# EAGLE design gatedriver_trafo_sma_compact_ACDC_SMD (EAGLE 7.2.0)
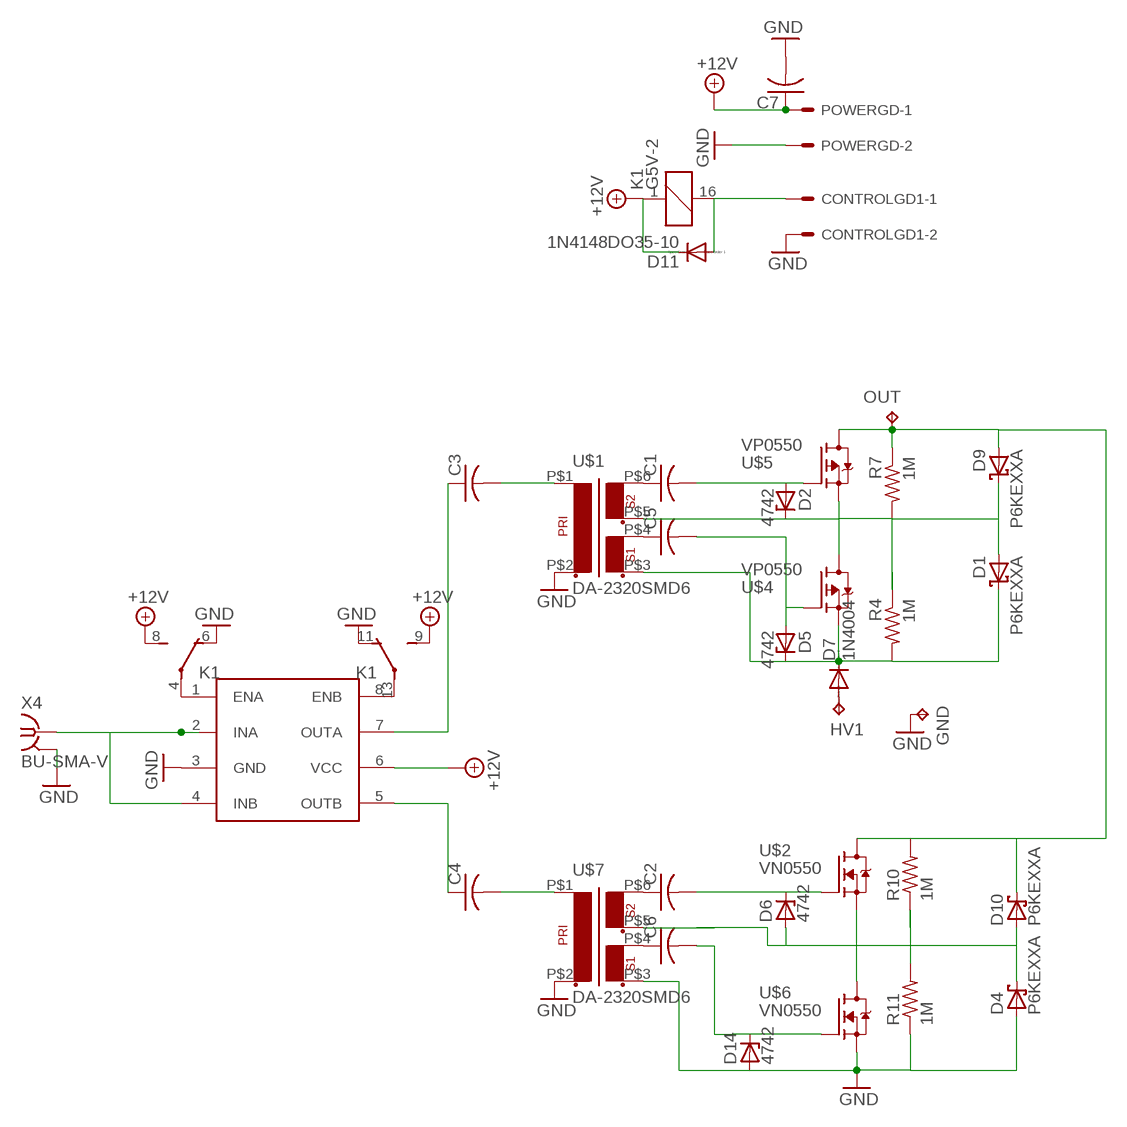
[diagram p0: schematic, sheet 1]

## Parts
C1  C-US050-055X075  [C050-055X075]
C2  C-US050-055X075  [C050-055X075]
C3  C-US050-055X075  [C050-055X075]
C4  C-US050-055X075  [C050-055X075]
C5  C-US050-055X075  [C050-055X075]
C6  C-US050-055X075  [C050-055X075]
C7  C-US050-030X075  [C050-030X075]
CONTROLGD1  KK-156-2  [KK-156-2]
D1  P6KEXXA  [C1702-15]
D2  4742  ZENER-DIODEZD-10  [ZDIO-10]
D4  P6KEXXA  [C1702-15]
D5  4742  ZENER-DIODEZD-10  [ZDIO-10]
D6  4742  ZENER-DIODEZD-10  [ZDIO-10]
D7  1N4004  [DO41-10]
D9  P6KEXXA  [C1702-15]
D10  P6KEXXA  [C1702-15]
D11  1N4148DO35-10  [DO35-10]
D14  4742  ZENER-DIODEZD-10  [ZDIO-10]
GND  TPPAD1-20Y  [P1-20Y]
HV1  TPPAD1-20Y  [P1-20Y]
K1  G5V-2  [G5V-2]
OUT  TPPAD1-20Y  [P1-20Y]
POWERGD  KK-156-2  [KK-156-2]
R4  1M  R-US_0207/12  [0207/12]
R7  1M  R-US_0207/12  [0207/12]
R10  1M  R-US_0207/12  [0207/12]
R11  1M  R-US_0207/12  [0207/12]
U$1  DA-2320SMD6  [SMD6]
U$2  VN0550  [TO92-]
U$3  UCC27425  [DIL08]
U$4  VP0550  [TO92-]
U$5  VP0550  [TO92-]
U$6  VN0550  [TO92-]
U$7  DA-2320SMD6  [SMD6]
X4  BU-SMA-V  [BU-SMA-V]

## Nets
+15V: C7.1 D11.C K1.1 K1.8(1:S) K1.9(2:S) POWERGD.1 U$3.6(VCC) ; supply symbol labelled +12V
ENSW: CONTROLGD1.1 D11.A K1.16
GND: C7.2 CONTROLGD1.2 D4.A D14.A GND.TP K1.6(1:O) K1.11(2:O) POWERGD.2 R11.1 U$1.P$2 U$3.3(GND) U$6.3(S) U$7.P$2 U$7.P$3 X4.2 X4.3 X4.4 X4.5
N$1: U$3.2(INA) U$3.4(INB) X4.1
N$2: C3.1 U$3.7(OUTA)
N$3: C3.2 U$1.P$1
N$4: C4.1 U$3.5(OUTB)
N$5: C1.1 U$1.P$6
N$6: C4.2 U$7.P$1
N$7: C5.1 U$1.P$4
N$9: U$7.P$5
N$11: C1.2 D2.A U$5.2(G)
N$13: D4.C D6.A D10.A R10.1 R11.2 U$2.3(S) U$6.1(D)
N$14: K1.4(1:P) U$3.1(ENA)
N$15: K1.13(2:P) U$3.8(ENB)
N$16: C5.2 D5.A U$4.2(G)
N$17: D1.C D5.C D7.C R4.2 U$1.P$3 U$4.3(S)
N$18: D1.A D2.C D9.C R4.1 R7.2 U$1.P$5 U$4.1(D) U$5.3(S)
N$21: D9.A D10.C OUT.TP R7.1 R10.2 U$2.1(D) U$5.1(D)
N$22: C2.1 U$7.P$6
N$23: C6.1 U$7.P$4
N$25: C2.2 D6.C U$2.2(G)
N$27: C6.2 D14.C U$6.2(G)
N$29: D7.A HV1.TP

## Library data of the parts
C1-C6 = resistor:C-US: CAPACITOR, American symbol
C7 = rcl:C-US: CAPACITOR, American symbol
CONTROLGD1 POWERGD = con-molex:KK-156-2: KK 156 HEADER Source: http://www.molex.com/pdm_docs/sd/026604100_sd.pdf; OC_FARNELL: unknown; OC_NEWARK: unknown
D1 D4 D9 D10 = diode:P6KEXXA: DIODE transient-voltage suppressor
D2 D5 D6 D14 = diode:ZENER-DIODE: Z-Diode
D7 = diode:1N4004: DIODE general purpose rectifier, 1 A
D11 = diode:1N4148: DIODE high speed (Philips)
GND HV1 OUT = testpad:TP: Test pad
K1 = relay:G5V-2: OMRON PCB Relay Source: http://www.omron.com/ecb/products/pdf/en-g5v2.pdf; MPN: G5V-2 5DC; OC_FARNELL: 9949488; OC_NEWARK: 78K5703
R4 R7 R10 R11 = rcl:R-US_: RESISTOR, American symbol
U$1 U$7 = trafo:DA-2320
U$2 U$6 = transistor-fet:VN0550
U$3 = texas:UCC27425
U$4 U$5 = transistor-fet:VP0550
X4 = con-coax:BU-SMA-V: FEMALE SMA CONNECTOR Radiall distributor RS 112-3794; OC_FARNELL: unknown; OC_NEWARK: unknown

## Board
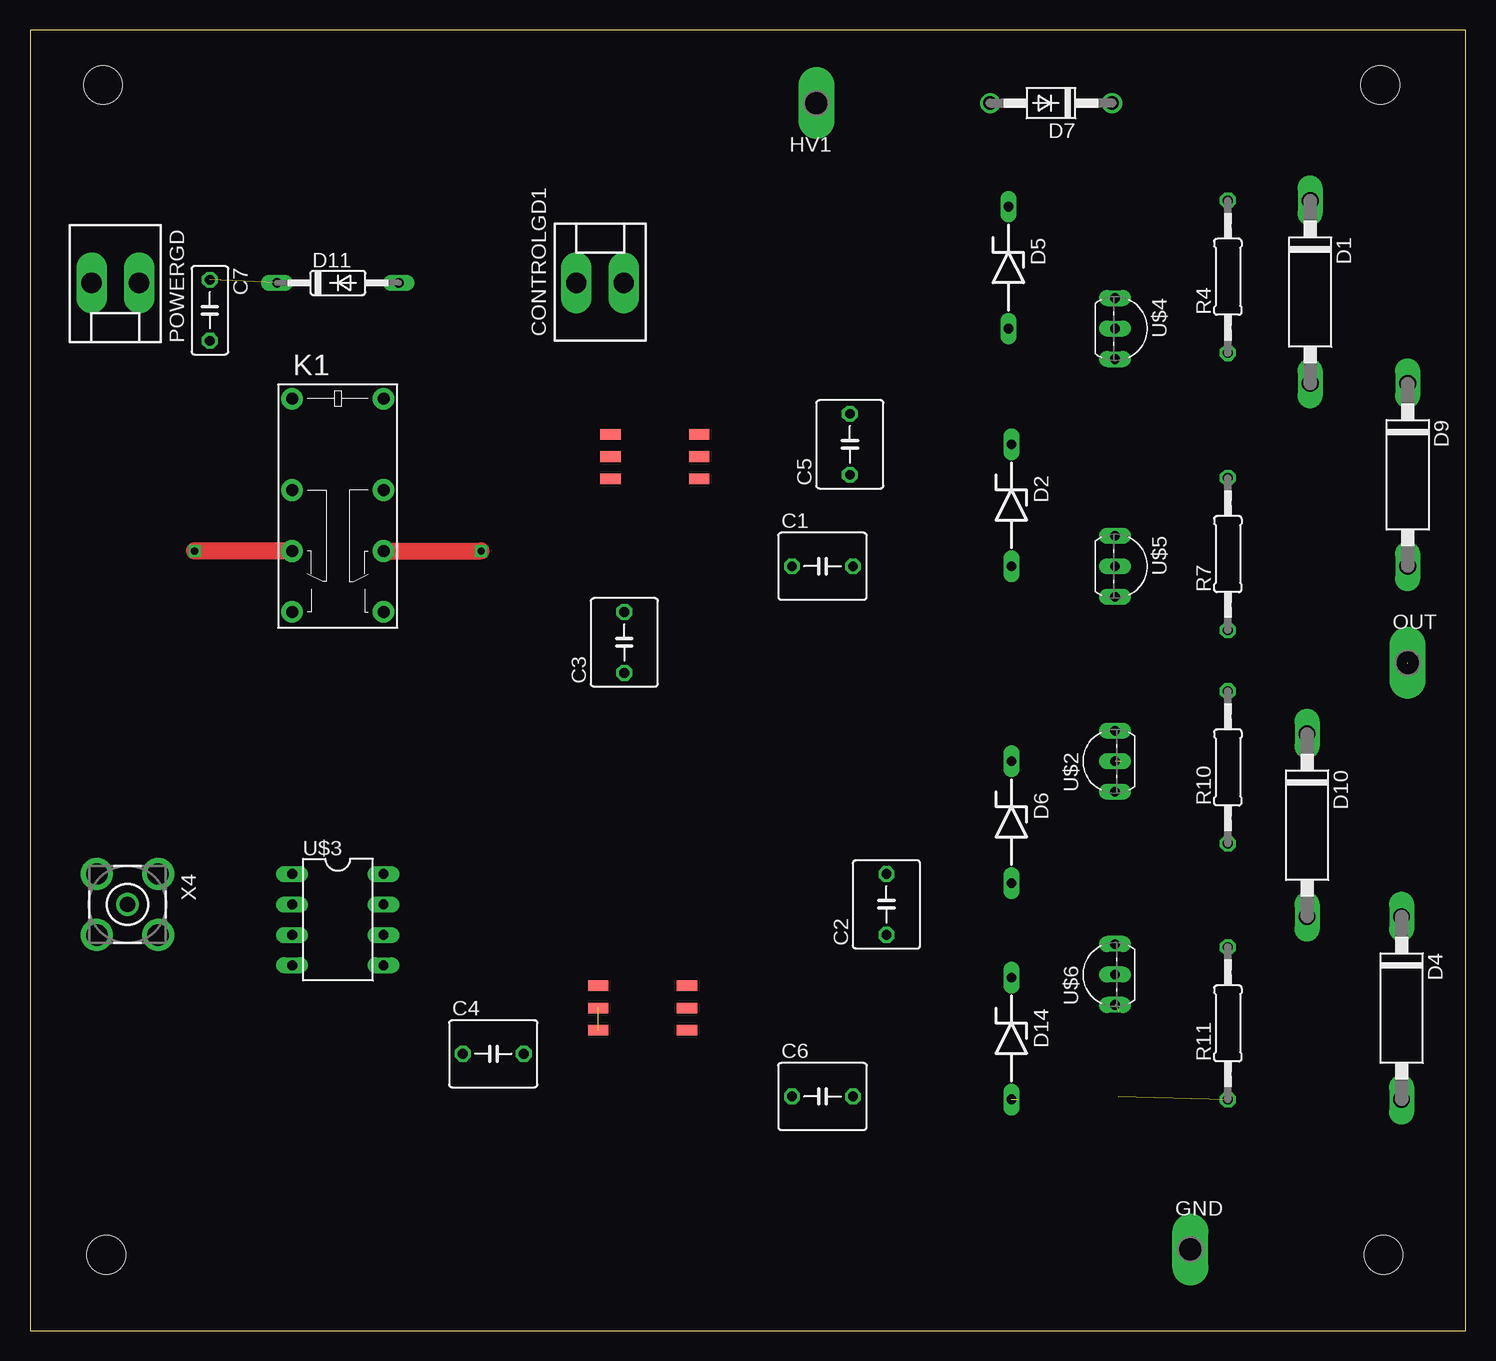
[diagram p1: board, top side]
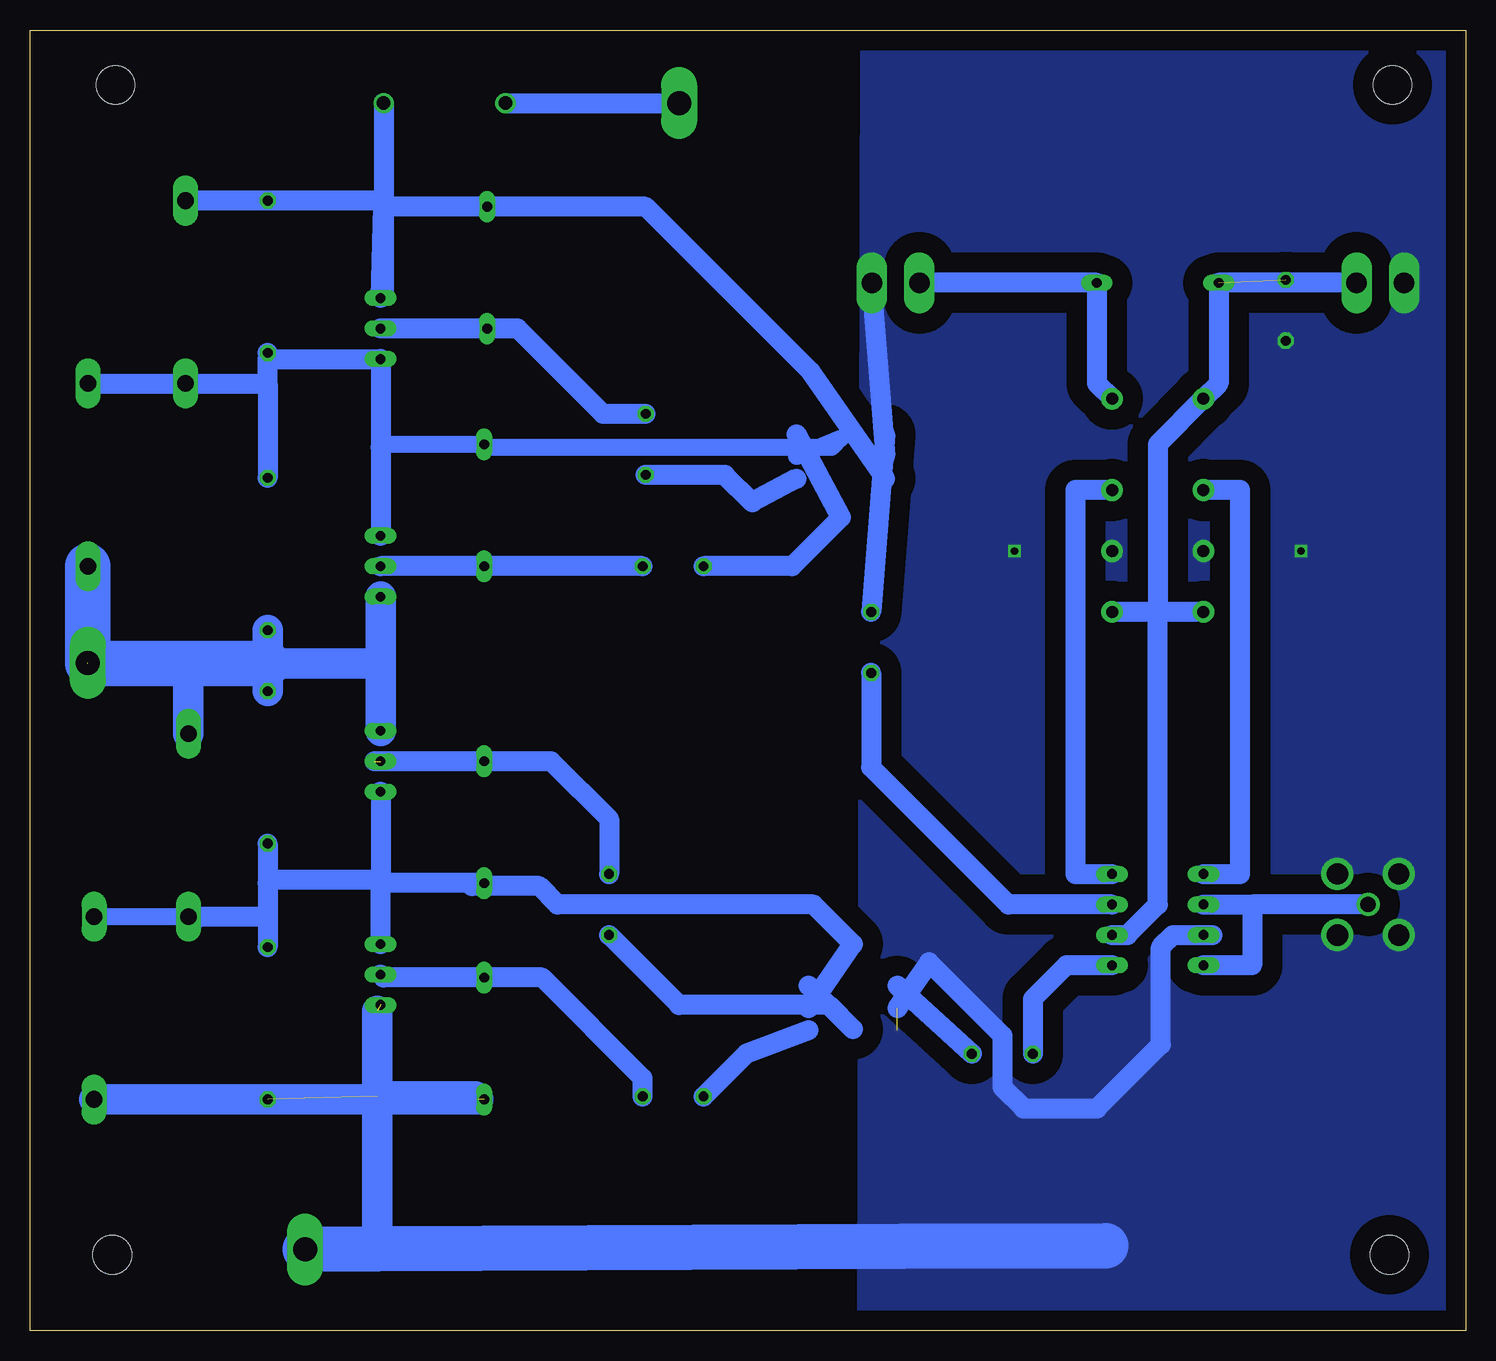
[diagram p2: board, bottom side, seen from below]

Size 119.63 x 108.46 mm. Coordinates in mm from the lower left corner, seen from the top.
Outline: 0,0 119.63,0 119.63,108.46 0,108.46 0,0
Copper layers (1*16): Top 0.035mm / dielectric 1.5mm / Bottom 0.035mm
Design rules "default": minimum track width 10mil, minimum drill 24mil, track to track 8mil, track to pad 8mil, pad to pad 8mil, via to via 8mil, smd to smd 8mil, copper to edge 40mil, drill to drill 8mil, minimum pad ring 10mil, minimum via ring 8mil, stop-mask expansion 4mil, vias tented up to drill 0mil, thermal gap 10mil
Holes 3.2 mm at 112.52,103.89 112.78,6.35 6.35,6.35 6.1,103.89

### Footprints (pad centres in the part's own frame; a part is rotated, then mirrored left to right if it is on the bottom)
C050-055X075 = drill 0.813 octagon: 1 -2.54,0; 2 2.54,0
C050-030X075 = drill 0.813 octagon: 1 -2.54,0; 2 2.54,0
KK-156-2 = drill 1.7 pad 2.184 long: 1 -1.98,0; 2 1.98,0
C1702-15 = drill 1.397 long: A 7.62,0; C -7.62,0
ZDIO-10 = drill 0.813 long: A 5.08,0; C -5.08,0
DO41-10 = drill 1.118: A 5.08,0; C -5.08,0
DO35-10 = drill 0.813 long: A 5.08,0; C -5.08,0
P1-20Y = drill 2.007 pad 2.54 long: TP 0,0
G5V-2 = drill 1 pad 1.8: 1 -8.89,-3.81; 4 -1.27,-3.81; 6 3.81,-3.81; 8 8.89,-3.81; 9 8.89,3.81; 11 3.81,3.81; 13 -1.27,3.81; 16 -8.89,3.81
0207/12 = drill 0.813 octagon: 1 -6.35,0; 2 6.35,0
SMD6 = smd 1.676 x 0.889: P$1 -3.696,1.854; P$2 -3.696,0; P$3 -3.696,-1.854; P$4 3.696,-1.854; P$5 3.696,0; P$6 3.696,1.854
TO92- = drill 0.813 long: 1 2.54,0; 2 0,0; 3 -2.54,0
DIL08 = drill 0.813 long: 1 -3.81,-3.81; 2 -1.27,-3.81; 3 1.27,-3.81; 4 3.81,-3.81; 5 3.81,3.81; 6 1.27,3.81; 7 -1.27,3.81; 8 -3.81,3.81
BU-SMA-V = drill 1.27: 1 0,0 | drill 1.778: 2 -2.55,2.55; 3 2.55,2.55; 4 2.55,-2.55; 5 -2.55,-2.55

### Placement (x,y rotation side)
C1  66.04,63.75 0 top
C2  71.37,35.56 90 top
C3  49.53,57.4 90 top
C4  38.61,23.11 0 top
C5  68.33,73.91 90 top
C6  66.04,19.56 0 top
C7  14.99,85.09 270 top
CONTROLGD1  47.5,87.38 0 top
D1  106.68,86.61 270 top
D2  81.79,68.83 270 top
D4  114.3,26.92 270 top
D5  81.53,88.65 270 top
D6  81.79,42.42 270 top
D7  85.09,102.36 180 top
D9  114.81,71.37 270 top
D10  106.43,42.16 270 top
D11  25.65,87.38 0 top
D14  81.79,24.38 270 top
GND  96.7,6.81 0 top
HV1  65.53,102.36 180 top
K1  25.65,68.83 270 top
OUT  114.81,55.7 0 top
POWERGD  7.11,87.38 180 top
R4  99.82,87.88 90 top
R7  99.82,64.77 90 top
R10  99.82,46.99 90 top
R11  99.82,25.65 90 top
U$1  52.07,72.9 0 top
U$2  90.42,47.5 90 top
U$3  25.65,34.29 270 top
U$4  90.42,83.57 270 top
U$5  90.42,63.75 270 top
U$6  90.42,29.72 90 top
U$7  51.05,26.92 0 top
X4  8.13,35.56 270 top

### Tracks (layer width: path | path; a pad name or v marks a point on that pad's centre or on a via)
+15V  (1 unrouted)
  Bottom 1.676: POWERGD.1 D11.C 20.57,78.99 K1.1 25.65,73.91 25.65,59.94 | 25.65,59.94 25.65,35.56 28.19,33.02 U$3.6 | 25.65,59.94 K1.9 | K1.8 25.65,59.94
ENSW
  Bottom 1.676: CONTROLGD1.1 D11.A 30.73,78.99 K1.16
GND  (via drill 0.6)  (4 unrouted)
  Top 1.422: K1.11 v37.59,65.02 | K1.6 v13.72,65.02
  Bottom 1.676: CONTROLGD1.2 49.53,87.38 U$1.P$2 | U$7.P$2 44.7,30.73 38.61,24.64 38.61,20.32 36.83,18.54 30.73,18.54 25.4,23.88 25.4,32 24.38,33.02 21.08,33.02
  Bottom 2.54: D4.A 82.3,19.3 82.55,19.56 90.68,19.56 90.68,26.67 90.68,6.84
  Bottom 3.81: GND.TP 90.68,6.84 46.94,7.06 29.97,7.11
  pour Bottom (isolate 1.676, no thermals): -0.25,108.46 50.29,108.71 50.55,0 0,-0.25
N$1
  Bottom 1.676: X4.1 17.78,35.56 | U$3.2 17.78,35.56 | 17.78,35.56 17.78,30.48 U$3.4
N$2
  Bottom 1.676: U$3.7 38.1,35.56 49.53,46.99 C3.1
N$3
  Bottom 1.676: U$1.P$1 C3.2
N$4
  Bottom 1.676: U$3.5 33.27,30.48 36.07,27.69 C4.1
N$5
  Bottom 1.676: U$1.P$6 52.07,67.82 56.13,63.75 C1.1
N$6
  Bottom 1.676: C4.2 U$7.P$1
N$7
  Bottom 1.676: U$1.P$4 59.44,69.09 61.72,71.37 C5.1
N$9
  Bottom 1.676: U$7.P$5 51.05,32.26 54.36,35.56 75.69,35.56 77.22,37.08 82.8,37.08
N$11
  Bottom 1.676: C1.2 D2.A U$5.2
N$13
  Bottom 1.422: D4.C D10.A 105.92,34.54 105.92,34.04
  Bottom 1.676: U$2.3 90.42,37.34 | R10.1 99.82,37.34 | 99.82,37.34 99.82,34.54 | 99.82,34.54 R11.2 | D10.A 99.82,34.54 | D6.A 90.42,37.34 | U$6.1 90.42,37.34 | 90.42,37.34 90.17,37.59 99.57,37.59 99.82,37.34
N$14
  Bottom 1.676: 21.34,38.1 U$3.1 18.8,38.1 18.8,70.1 K1.4
N$15
  Bottom 1.676: K1.13 32.51,70.1 32.51,38.1 U$3.8
N$16
  Bottom 1.676: C5.2 71.88,76.45 78.99,83.57 D5.A U$4.2
N$17
  Bottom 1.676: D7.C 90.17,94.23 | 90.17,94.23 90.17,86.36 U$4.3 90.19,93.72 | 90.19,93.72 90.17,94.23 | 90.17,94.23 R4.2 D1.C | 90.19,93.72 90.19,93.73 D5.C 68.33,93.73 54.61,80.01 U$1.P$3
N$18
  Bottom 1.422: U$1.P$5 52.07,74.42 52.83,73.66 81.53,73.66 D2.C 90.17,73.91 90.42,73.66
  Bottom 1.676: U$5.3 90.42,73.66 U$4.1 99.82,81.03 | D9.C D1.A 99.82,78.99 | 99.82,78.99 99.82,81.03 | 99.82,78.99 R7.2 | R4.1 99.82,81.03
N$21  (1 unrouted)
  Bottom 2.54: U$5.1 90.42,55.63 | 90.42,55.63 U$2.1 | 99.82,55.63 R10.2 | D10.C 106.43,55.63 | R7.1 99.82,55.63 | 99.82,55.63 90.42,55.63
  Bottom 3.81: D9.A 114.81,55.63 106.43,55.63 99.82,55.63
N$22
  Bottom 1.676: U$7.P$6 51.05,25.15 53.09,27.18 65.53,27.18 C2.1
N$23
  Bottom 1.676: U$7.P$4 59.94,23.11 C6.1
N$25  (1 unrouted)
  Bottom 1.676: C2.2 71.37,42.67 76.2,47.5 D6.C 90.93,47.5
N$27
  Bottom 1.676: U$6.2 90.17,29.46 D14.C 76.96,29.46 68.58,21.08 C6.2
N$29
  Bottom 1.676: D7.A HV1.TP